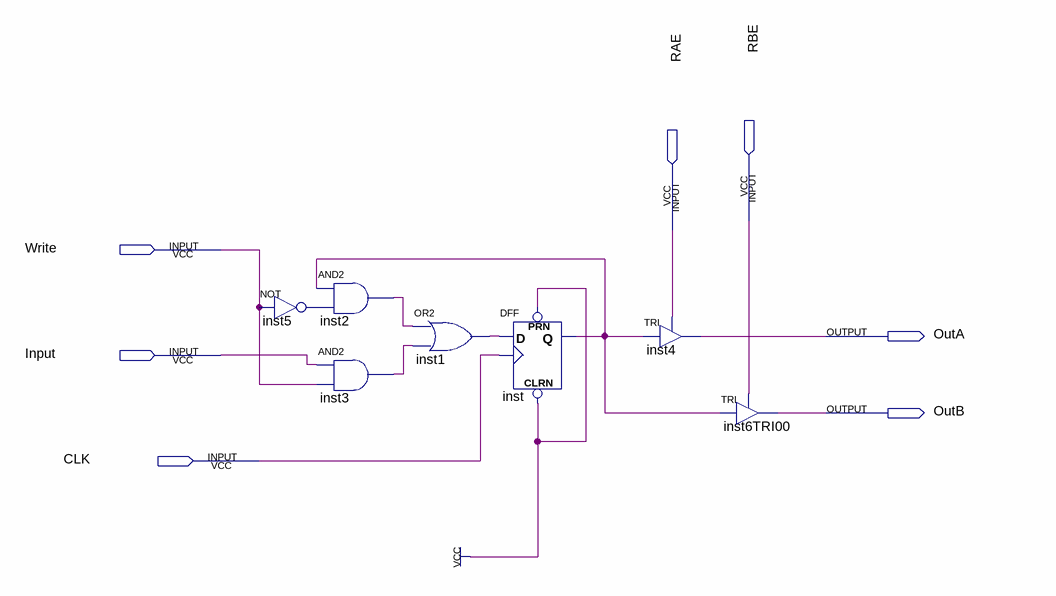
[diagram p0: schematic sheet]
// Quartus schematic RFC.bdf as structural Verilog: 7 symbols, 7 pins
module RFC (
  input  RBE,
  input  RAE,
  input  Write,
  input  Input,
  input  CLK,
  output OutA,
  output OutB
);

  wire inst1_out, inst2_out, inst3_out, inst5_out, inst_q;

  not inst5 (inst5_out, Write);
  and inst2 (inst2_out, inst_q, inst5_out);
  and inst3 (inst3_out, Input, Write);
  or inst1 (inst1_out, inst2_out, inst3_out);
  DFF inst (.CLRN(1'b1), .CLK(CLK), .D(inst1_out), .PRN(1'b1), .Q(inst_q));
  TRI inst4 (.IN(inst_q), .OE(RAE), .OUT(OutA));
  TRI inst6TRI00 (.IN(inst_q), .OE(RBE), .OUT(OutB));
endmodule
